# Altium project 3PDT_Board.PrjPcb
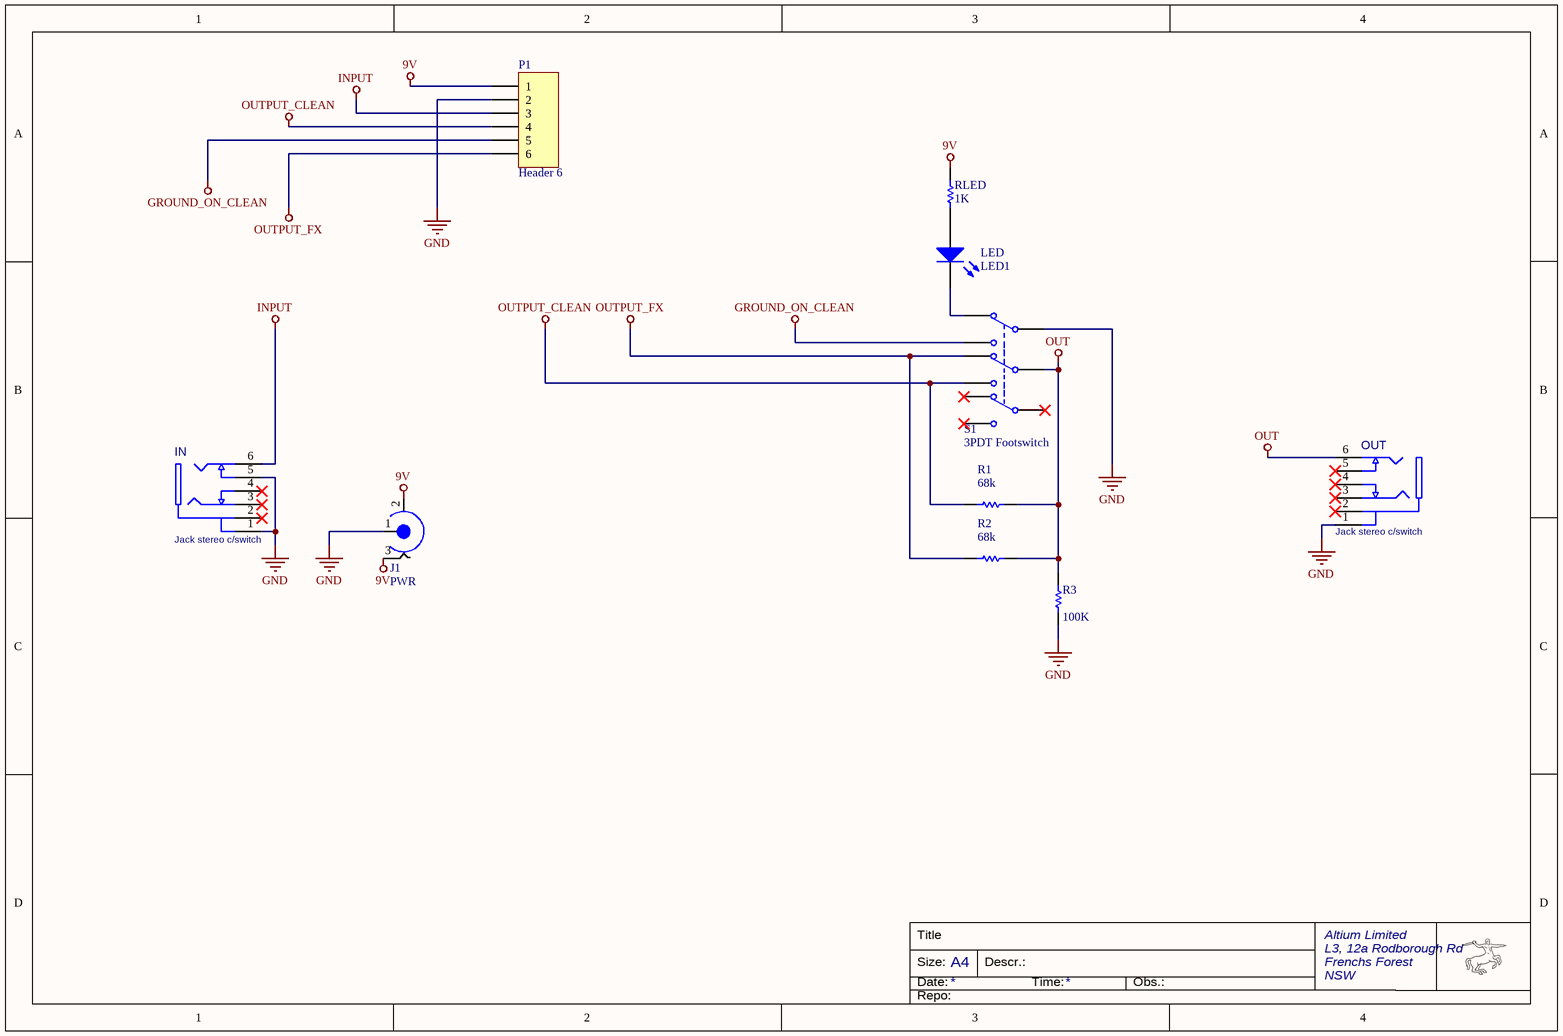
[diagram p0: 3PDT.SchDoc]
1 sheet, 10 parts. Net scope: global (net labels, ports and power ports of the same name join across sheets).
Board file: 3PDT.PcbDoc

## Sheet 3PDT.SchDoc
size A4; Organization: Altium Limited; Address1: L3, 12a Rodborough Rd; Address2: Frenchs Forest; Address3: NSW; Address4: Australia 2086

### Parts
IN  Jack stereo c/switch  [NMJ6HCD2]
J1  PWR  [Power Connector Round Pads]
LED  LED1  [LED]
OUT  Jack stereo c/switch  [NMJ6HCD2]
P1  Header 6  [Header 6]
R1  value 68k  [Res 0.2]  (hidden comment: Res1)
R2  value 68k  [Res 0.2]  (hidden comment: Res1)
R3  value 100K  [Res 0.2]  (hidden comment: Res1)
RLED  value 1K  [Res 0.2]  (hidden comment: Res1)
S1  3PDT Footswitch  [3PDT FOOTSWITCH]

### Nets
9V: J1.2 J1.3 P1.1 RLED.2
GND: IN.1 IN.5 J1.1 OUT.1 P1.2 R3.1 S1.2a(COMMON1)
GROUND_ON_CLEAN: P1.5 S1.3a(NO1)
INPUT: IN.6 P1.3
OUT: OUT.6 R1.1 R2.1 R3.2 S1.2b(COMMON2)
OUTPUT_CLEAN: P1.4 R1.2 S1.3b(NO2)
OUTPUT_FX: P1.6 R2.2 S1.1b(NC2)
NetLED_1: LED.1(A) RLED.1
NetLED_2: LED.2(K) S1.1a(NC1)

Not connected (* = marked no-connect by the designer): IN 2* 3* 4*; OUT 2* 3* 4* 5*; S1 1c(NC3)* 2c(COMMON3)* 3c(NO3)*

### Notes on the sheet
- Title
- Size:
- Date:
- A4
- Descr.:
- Time:
- Obs.:
- Repo:

### Library data of the parts
IN OUT = NMJ6HCD2: Jack 1/4" Stereo Switched; pin to pad: 5>6 6>5; MF: Neutrik; PN: 000000; ExtraInfo: *; MF PN: NMJ6HCD2; Package: PTH; Price: *; DigiKey PN: *; VALUE: NMJ6HCD2
J1 = Power Connector
LED = LED1: Typical RED GaAs LED; Published: 8-Jun-2000; LatestRevisionDate: 08-Jul-2005; LatestRevisionNote: Mech Layer 1 removed.; PackageReference: LED-1; Publisher: Altium Limited; PackageDescription: LED; 2 Leads
P1 = Header 6: Header, 6-Pin; LatestRevisionDate: 17-Jul-2002; LatestRevisionNote: Re-released for DXP Platform.; Publisher: Altium Limited
R1-R3 RLED = Res1: Resistor; Published: 8-Jun-2000; LatestRevisionDate: 17-Jul-2002; LatestRevisionNote: Re-released for DXP Platform.; PackageReference: AXIAL-0.3; Publisher: Altium Limited; PackageDescription: Axial Device, Thru-Hole; 2 Leads; 0.3 in Pin Spacing